# Altium schematic sheet Rainbow F103C_Sch.SchDoc
size A4
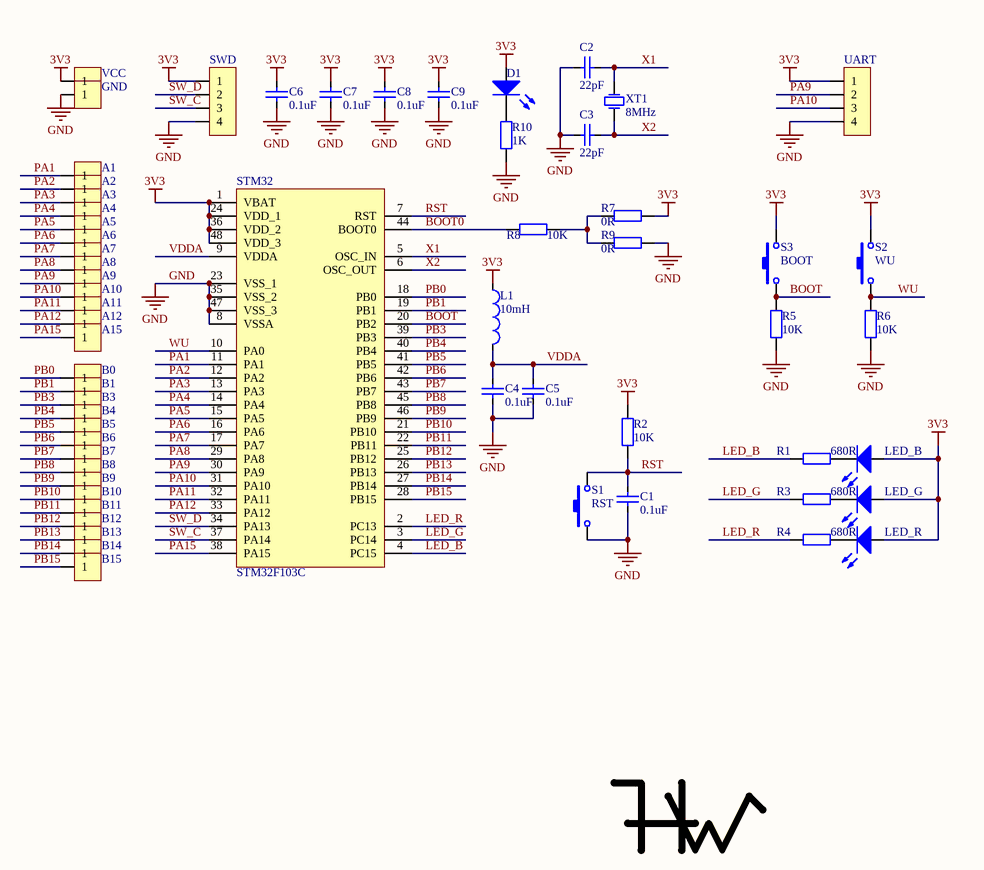
[diagram p0: Rainbow F103C_Sch.SchDoc]

## Parts
A1  HDR1X1_180_2.54  [HDR1X1_180_2.54]  (value not drawn)
A2  HDR1X1_180_2.54  [HDR1X1_180_2.54]  (value not drawn)
A3  HDR1X1_180_2.54  [HDR1X1_180_2.54]  (value not drawn)
A4  HDR1X1_180_2.54  [HDR1X1_180_2.54]  (value not drawn)
A5  HDR1X1_180_2.54  [HDR1X1_180_2.54]  (value not drawn)
A6  HDR1X1_180_2.54  [HDR1X1_180_2.54]  (value not drawn)
A7  HDR1X1_180_2.54  [HDR1X1_180_2.54]  (value not drawn)
A8  HDR1X1_180_2.54  [HDR1X1_180_2.54]  (value not drawn)
A9  HDR1X1_180_2.54  [HDR1X1_180_2.54]  (value not drawn)
A10  HDR1X1_180_2.54  [HDR1X1_180_2.54]  (value not drawn)
A11  HDR1X1_180_2.54  [HDR1X1_180_2.54]  (value not drawn)
A12  HDR1X1_180_2.54  [HDR1X1_180_2.54]  (value not drawn)
A15  HDR1X1_180_2.54  [HDR1X1_180_2.54]  (value not drawn)
B0  HDR1X1_180_2.54  [HDR1X1_180_2.54]  (value not drawn)
B1  HDR1X1_180_2.54  [HDR1X1_180_2.54]  (value not drawn)
B3  HDR1X1_180_2.54  [HDR1X1_180_2.54]  (value not drawn)
B4  HDR1X1_180_2.54  [HDR1X1_180_2.54]  (value not drawn)
B5  HDR1X1_180_2.54  [HDR1X1_180_2.54]  (value not drawn)
B6  HDR1X1_180_2.54  [HDR1X1_180_2.54]  (value not drawn)
B7  HDR1X1_180_2.54  [HDR1X1_180_2.54]  (value not drawn)
B8  HDR1X1_180_2.54  [HDR1X1_180_2.54]  (value not drawn)
B9  HDR1X1_180_2.54  [HDR1X1_180_2.54]  (value not drawn)
B10  HDR1X1_180_2.54  [HDR1X1_180_2.54]  (value not drawn)
B11  HDR1X1_180_2.54  [HDR1X1_180_2.54]  (value not drawn)
B12  HDR1X1_180_2.54  [HDR1X1_180_2.54]  (value not drawn)
B13  HDR1X1_180_2.54  [HDR1X1_180_2.54]  (value not drawn)
B14  HDR1X1_180_2.54  [HDR1X1_180_2.54]  (value not drawn)
B15  HDR1X1_180_2.54  [HDR1X1_180_2.54]  (value not drawn)
C1  value 0.1uF  [CAP_0603]  (hidden comment: Cap_0603)
C2  value 22pF  [CAP_0603]  (hidden comment: Cap_0603)
C3  value 22pF  [CAP_0603]  (hidden comment: Cap_0603)
C4  value 0.1uF  [CAP_0603]  (hidden comment: Cap_0603)
C5  value 0.1uF  [CAP_0603]  (hidden comment: Cap_0603)
C6  value 0.1uF  [CAP_0603]  (hidden comment: Cap_0603)
C7  value 0.1uF  [CAP_0603]  (hidden comment: Cap_0603)
C8  value 0.1uF  [CAP_0603]  (hidden comment: Cap_0603)
C9  value 0.1uF  [CAP_0603]  (hidden comment: Cap_0603)
D1  LED_0603_BLUE  [LED_0603_BLUE]  (value not drawn)
GND  HDR1X1_180_2.54  [HDR1X1_180_2.54]  (value not drawn)
L1  value 10mH  [IND_0603]  (hidden comment: Ind_0603)
LED_B  LED_0603_BLUE  [LED_0603_BLUE]  (value not drawn)
LED_G  LED_0603_GREEN  [LED_0603_GREEN]  (value not drawn)
LED_R  LED_0603_RED  [LED_0603_RED]  (value not drawn)
Mark1  Mark  [HW_Mark]  (value not drawn)
R1  value 680R  [RES_0603]  (hidden comment: Res_0603)
R2  value 10K  [RES_0603]  (hidden comment: Res_0603)
R3  value 680R  [RES_0603]  (hidden comment: Res_0603)
R4  value 680R  [RES_0603]  (hidden comment: Res_0603)
R5  value 10K  [RES_0603]  (hidden comment: Res_0603)
R6  value 10K  [RES_0603]  (hidden comment: Res_0603)
R7  value 0R  [RES_0603]  (hidden comment: Res_0603)
R8  value 10K  [RES_0603]  (hidden comment: Res_0603)
R9  value 0R  [RES_0603]  (hidden comment: Res_0603)
R10  value 1K  [RES_0603]  (hidden comment: Res_0603)
S1  RST  [BT_TACT]
S2  WU  [BT_TACT]
S3  BOOT  [BT_TACT]
STM32  STM32F103C  [STM32F_48]
SWD  HDR1X4_90F_2.54  [HDR1X4_90F_2.54]  (value not drawn)
UART  HDR1X4_90F_2.54  [HDR1X4_90F_2.54]  (value not drawn)
VCC  HDR1X1_180_2.54  [HDR1X1_180_2.54]  (value not drawn)
XT1  value 8MHz  [XTAL_5032]  (hidden comment: XTAL_5032)

## Nets
3V3: C6.2 C7.2 C8.2 C9.2 D1.1(A) L1.1 LED_B.1(A) LED_G.1(A) LED_R.1(A) R2.1 R7.2 S2.2 S3.2 STM32.1(VBAT) STM32.24(VDD_1) STM32.36(VDD_2) STM32.48(VDD_3) SWD.1 UART.1 VCC.1
GND: C1.2 C2.1 C3.1 C4.2 C5.2 C6.1 C7.1 C8.1 C9.1 GND.1 R5.2 R6.2 R9.2 R10.1 S1.1 STM32.8(VSSA) STM32.23(VSS_1) STM32.35(VSS_2) STM32.47(VSS_3) SWD.4 UART.4
BOOT: R5.1 S3.1 STM32.20(PB2)
BOOT0: R8.1 STM32.44(BOOT0)
LED_B: R1.1 STM32.4(PC15)
LED_G: R3.1 STM32.3(PC14)
LED_R: R4.1 STM32.2(PC13)
PA1: A1.1 STM32.11(PA1)
PA2: A2.1 STM32.12(PA2)
PA3: A3.1 STM32.13(PA3)
PA4: A4.1 STM32.14(PA4)
PA5: A5.1 STM32.15(PA5)
PA6: A6.1 STM32.16(PA6)
PA7: A7.1 STM32.17(PA7)
PA8: A8.1 STM32.29(PA8)
PA9: A9.1 STM32.30(PA9) UART.2
PA10: A10.1 STM32.31(PA10) UART.3
PA11: A11.1 STM32.32(PA11)
PA12: A12.1 STM32.33(PA12)
PA15: A15.1 STM32.38(PA15)
PB0: B0.1 STM32.18(PB0)
PB1: B1.1 STM32.19(PB1)
PB3: B3.1 STM32.39(PB3)
PB4: B4.1 STM32.40(PB4)
PB5: B5.1 STM32.41(PB5)
PB6: B6.1 STM32.42(PB6)
PB7: B7.1 STM32.43(PB7)
PB8: B8.1 STM32.45(PB8)
PB9: B9.1 STM32.46(PB9)
PB10: B10.1 STM32.21(PB10)
PB11: B11.1 STM32.22(PB11)
PB12: B12.1 STM32.25(PB12)
PB13: B13.1 STM32.26(PB13)
PB14: B14.1 STM32.27(PB14)
PB15: B15.1 STM32.28(PB15)
RST: C1.1 R2.2 S1.2 STM32.7(RST)
SW_C: STM32.37(PA14) SWD.3
SW_D: STM32.34(PA13) SWD.2
VDDA: C4.1 C5.1 L1.2 STM32.9(VDDA)
WU: R6.1 S2.1 STM32.10(PA0)
X1: C2.2 STM32.5(OSC_IN) XT1.2(OSC2)
X2: C3.2 STM32.6(OSC_OUT) XT1.1(OSC1)
NetD1_2: D1.2(K) R10.2
NetLED_B_2: LED_B.2(K) R1.2
NetLED_G_2: LED_G.2(K) R3.2
NetLED_R_2: LED_R.2(K) R4.2
NetR7_1: R7.1 R8.2 R9.1

## Library data of the parts
A1-A12 A15 B0 B1 B3-B15 GND VCC = HDR1X1_180_2.54: Header
C1-C9 = Cap_0603: Capacitor
D1 LED_B = LED_0603_BLUE: LED
L1 = Ind_0603: Inductor
LED_G = LED_0603_GREEN: LED
LED_R = LED_0603_RED: LED
Mark1 = HW
R1-R10 = Res_0603: Resistor
S1-S3 = BT_TACT: Switch
STM32 = STM32F103C: MCU
SWD UART = HDR1X4_90F_2.54: Header
XT1 = XTAL_5032: Crystal Oscillator; Published: 8-Jun-2000; LatestRevisionDate: 17-Jul-2002; LatestRevisionNote: Re-released for DXP Platform.; PackageReference: R38; Publisher: Altium Limited; PackageDescription: Crystal, Thru-Hole; 2 Leads; Body 3.1 x 8.2 mm (Dia.xH)